# EAGLE design astablemultivibrator (EAGLE 6.4)
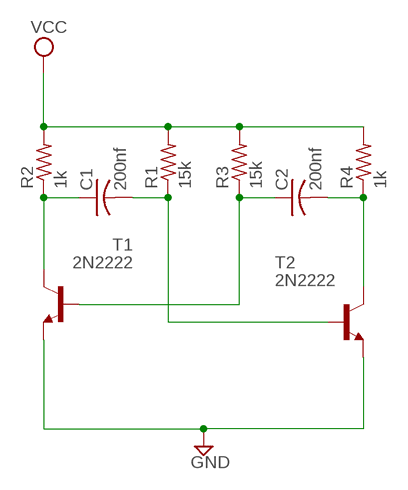
[diagram p0: schematic, sheet 1]

## Parts
C1  200nf  C-US025-030X050  [C025-030X050]
C2  200nf  C-US025-030X050  [C025-030X050]
R1  15k  R-US_0309/12  [0309/12]
R2  1k  R-US_0309/12  [0309/12]
R3  15k  R-US_0309/12  [0309/12]
R4  1k  R-US_0309/12  [0309/12]
T1  2N2222  [TO92-EBC-OVAL]
T2  2N2222  [TO92-EBC-OVAL]

## Nets
GND: T1.E T2.E
N$1: C1.1 R2.1 T1.C
N$2: C1.2 R1.1 T2.B
N$3: C2.1 R3.1 T1.B
N$4: C2.2 R4.1 T2.C
VCC: R1.2 R2.2 R3.2 R4.2

## Library data of the parts
C1 C2 = adafruit:C-US: CAPACITOR, American symbol
R1-R4 = adafruit:R-US_: RESISTOR, American symbol
T1 T2 = adafruit:2N2222: NPN TRANSISTOR Big oval pads

## Board
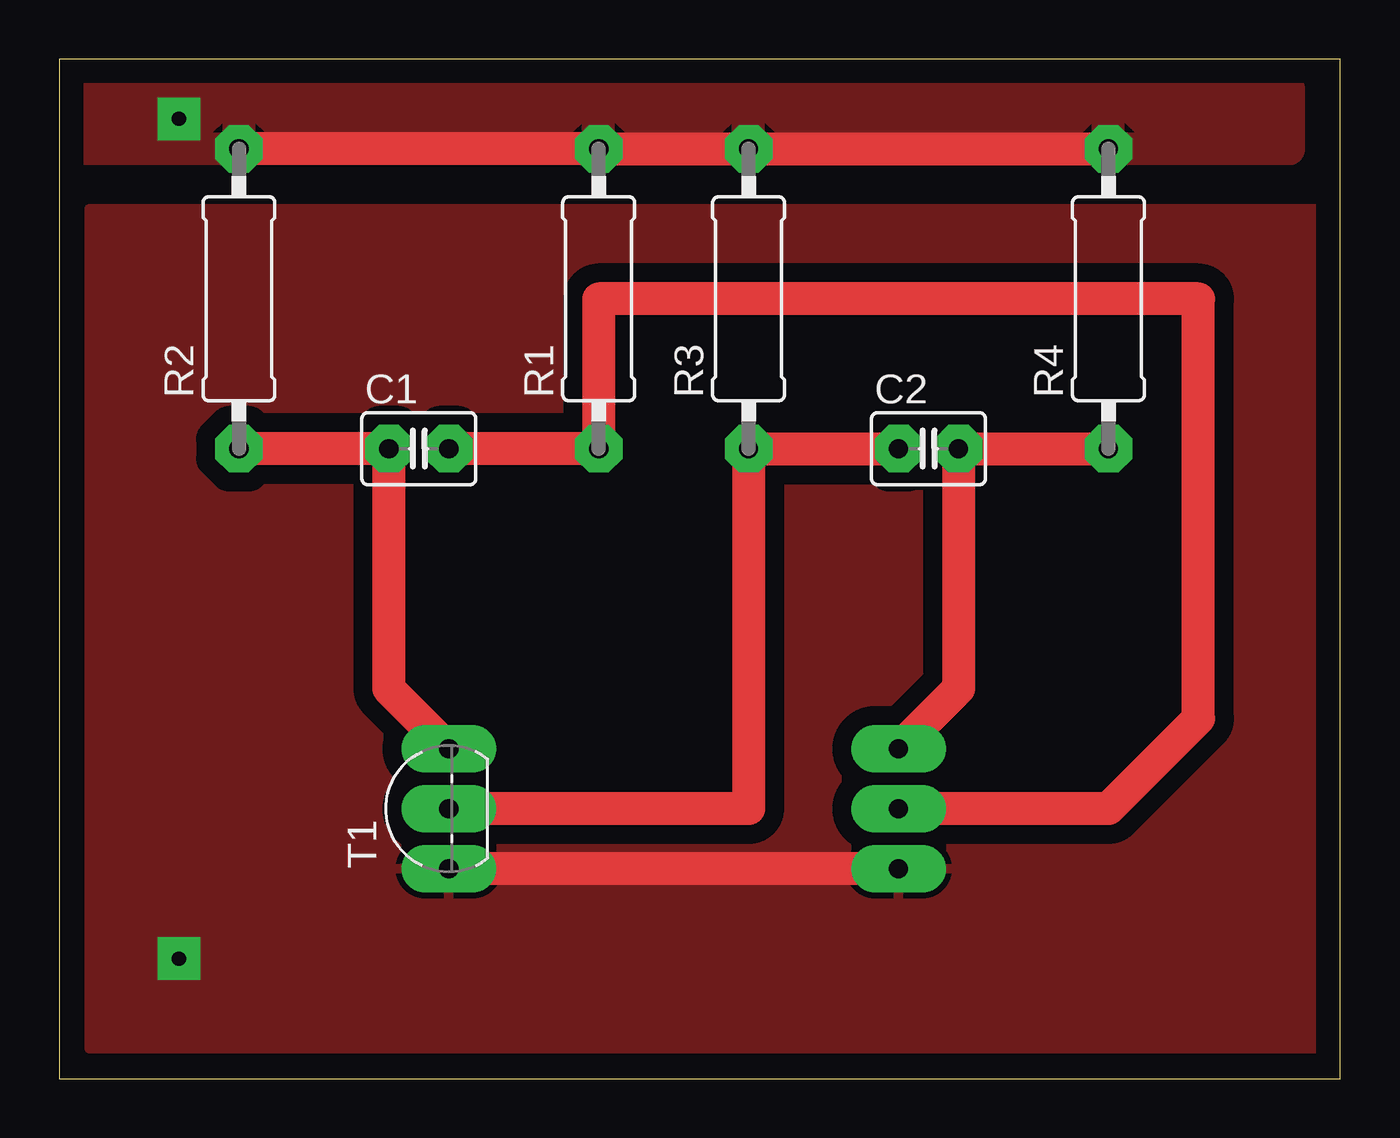
[diagram p1: board, top side]
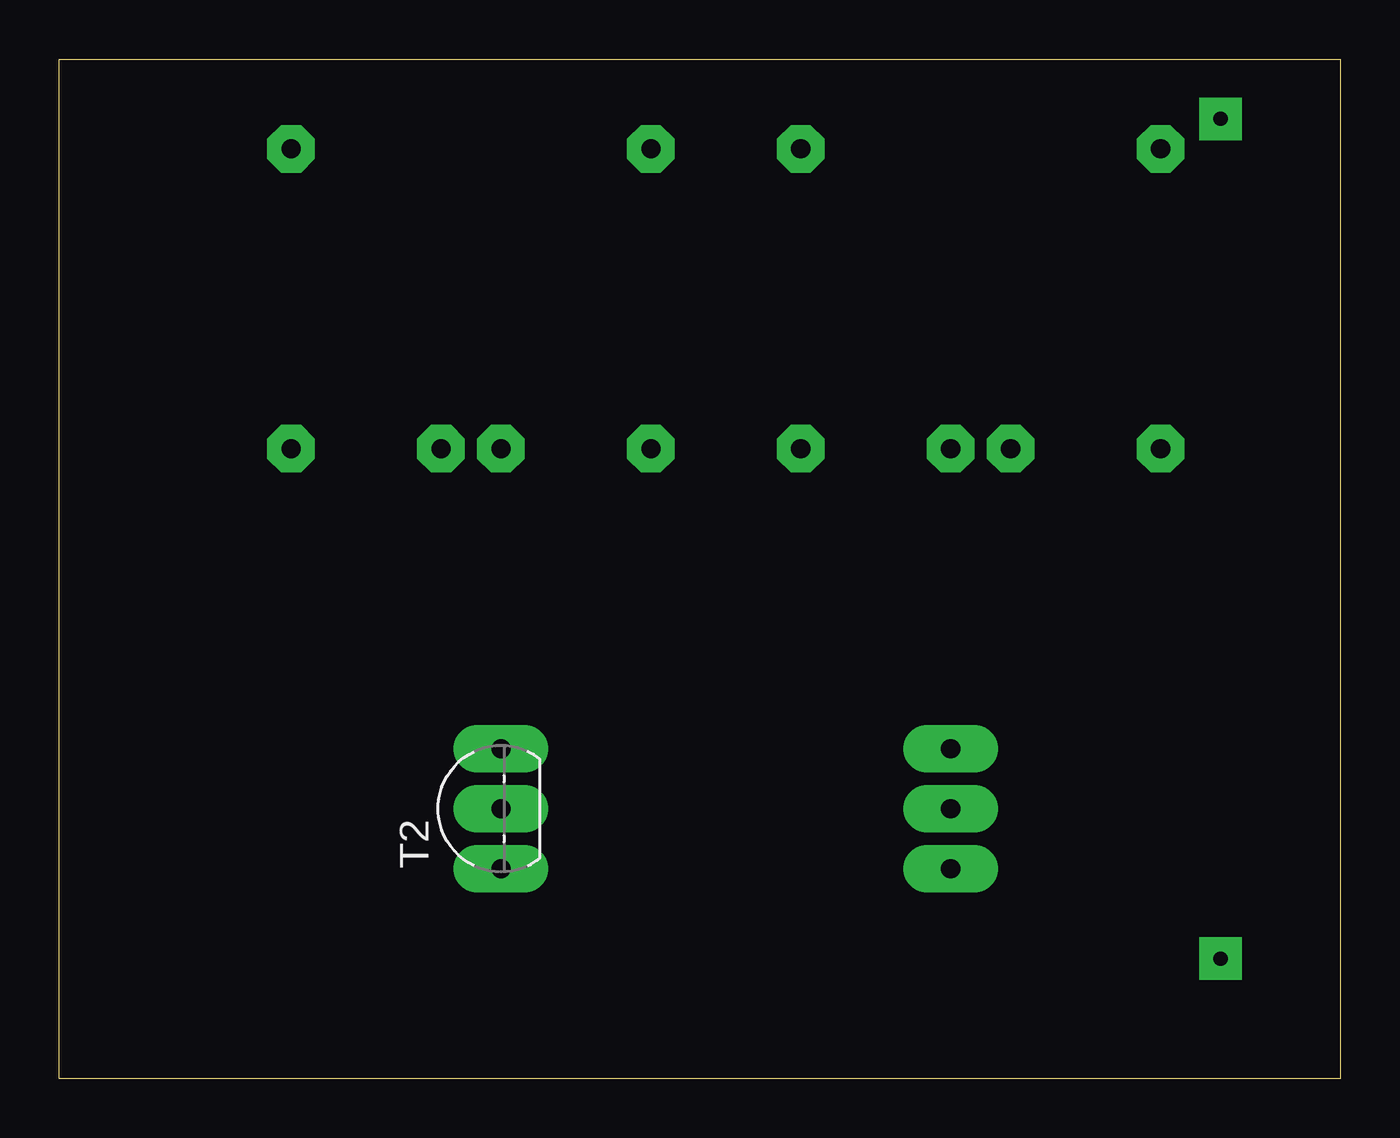
[diagram p2: board, bottom side, seen from below]

Size 54.28 x 43.17 mm. Coordinates in mm from the lower left corner, seen from the top.
Outline: 0,0 54.28,0 54.28,43.17 0,43.17 0,0
Copper layers (1*16): Top 0.035mm / dielectric 1.5mm / Bottom 0.035mm
Design rules "johnsrules": minimum track width 0.8mm, minimum drill 0.8mm, track to track 0.8mm, track to pad 0.8mm, pad to pad 0.8mm, via to via 0.8mm, smd to smd 8mil, copper to edge 40mil, drill to drill 8mil, minimum pad ring 0.6mm, minimum via ring 0.6mm, stop-mask expansion 4mil, vias tented up to drill 0mil, thermal gap 10mil

### Footprints (pad centres in the part's own frame; a part is rotated, then mirrored left to right if it is on the bottom)
C025-030X050 = drill 0.813 pad 1.422 octagon: 1 -1.27,0; 2 1.27,0
0309/12 = drill 0.813 pad 1.676 octagon: 1 -6.35,0; 2 6.35,0
TO92-EBC-OVAL = drill 0.813 long: B 0,-1.27; C 2.54,-1.27; E -2.54,-1.27

### Placement (x,y rotation side)
C1  15.24,26.67 0 top
C2  36.83,26.67 0 top
R1  22.86,33.02 90 top
R2  7.62,33.02 90 top
R3  29.21,33.02 90 top
R4  44.45,33.02 90 top
T1  15.24,11.43 90 top
T2  36.83,11.43 90 bottom

### Tracks (layer width: path | path; a pad name or v marks a point on that pad's centre or on a via)
GND  (via drill 0.6)
  Top 1.4: T2.E T1.E
  other vias: 5.08,5.08
  pour Top: 1.27,36.83 53.34,36.83 53.34,1.27 1.27,1.27
N$1
  Top 1.4: R2.1 C1.1 13.97,16.51 T1.C
N$2
  Top 1.4: R1.1 C1.2 | R1.1 20.32,26.67 | T2.B 44.45,11.43 48.26,15.24 48.26,33.02 22.86,33.02 R1.1
N$3
  Top 1.4: T1.B 29.21,11.43 R3.1 C2.1
N$4
  Top 1.4: T2.C 38.1,16.51 C2.2 R4.1
VCC  (via drill 0.6)
  Top 1.4: R2.2 R1.2 R3.2 R4.2
  other vias: 5.08,40.64
  pour Top: 52.07,39.37 1.27,39.37 1.27,41.91 52.07,41.91